# Altium schematic sheet TPS7A2050PDBVR.schdoc
size 127 x 101 mm
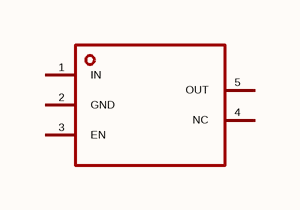
[diagram p0: TPS7A2050PDBVR.schdoc]

## Parts
U?  tps7a2050pdbvr  [SOT-23-5_L2.9-W1.6-P0.95-LS2.8-BR]  (value not drawn)

## Nets

Not connected (* = marked no-connect by the designer): U? 1(IN) 2(GND) 3(EN) 4(NC) 5(OUT)

## Library data of the parts
U? = tps7a2050pdbvr: 输出极性:正极;工作电压:6V;输出电压:5V;输出电流:300mA;电源纹波抑制比(PSRR):65dB@(100Hz);输出类型:固定;; Manufacturer: TI(德州仪器); AddInBom: yes; ModelId: 7ba65df16e7b4570af156e925f9c37fe; ModelTransform: 114.173,114.173,0,90,0,0,0,0,0; Output Configuration: 正极; Voltage - Supply: 6V; Output Voltage: 5V; Output Current: 300mA; Voltage Dropout: 140mV@(300mA); standby current: 6.5uA; Noise: 10uVrms; Output Type: 固定; Number of Outputs: 1; Symbol: TPS7A2050PDBVR; LCSC Part Name: 800mV~5.5V 300mA 6V; SupplierPart: C2864504; ManufacturerPart: TPS7A2050PDBVR; Supplier Footprint: SOT-23-5; JLCPCB Part Class: Extended Part; Datasheet: https://www.ti.com/cn/lit/ds/symlink/tps7a20.pdf; Supplier: LCSC; ConvertToPcb: yes; FootprintName: SOT-23-5_L2.9-W1.6-P0.95-LS2.8-BR; ModelName: SOT-23-5_L2.9-W1.6-P0.95-LS2.8-BR; Power Supply Rejection Ratio (PSRR): 65dB@(100Hz); Features: 使能控制；输入欠压保护；内置软启动；短路保护；过流保护；输出放电；热关断; Operating Temperature: -40℃~+125℃@(Tj)